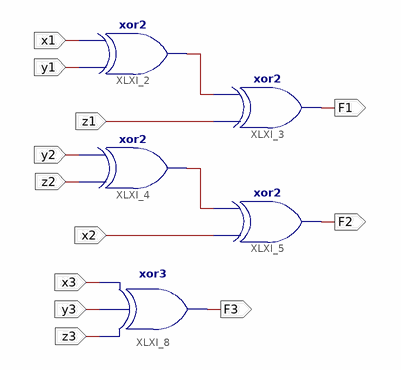
[diagram p0: schematic sheet 1]
// Xilinx ISE schematic Ex3.sch (spartan6) as structural Verilog: 5 symbols, 12 ports
module Ex3 (
  input  x1,
  input  y1,
  input  z1,
  input  y2,
  input  z2,
  input  x2,
  input  x3,
  input  y3,
  input  z3,
  output F1,
  output F2,
  output F3
);

  wire XLXN_4, XLXN_9;

  xor XLXI_2 (XLXN_4, y1, x1);
  xor XLXI_3 (F1, z1, XLXN_4);
  xor XLXI_4 (XLXN_9, z2, y2);
  xor XLXI_5 (F2, x2, XLXN_9);
  xor XLXI_8 (F3, z3, y3, x3);
endmodule
